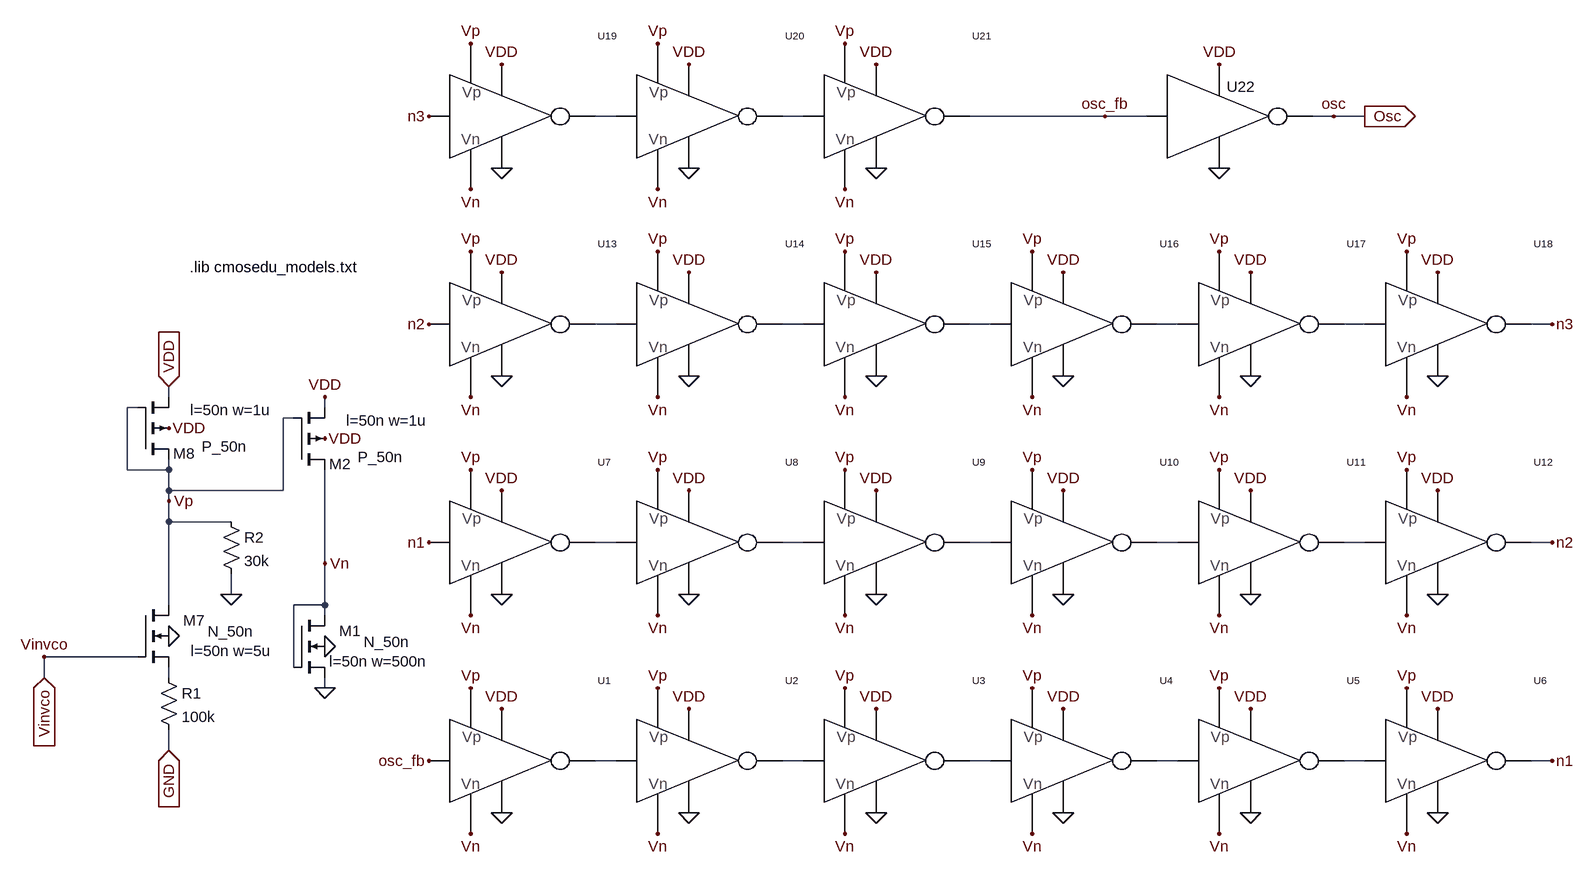
[diagram p0: schematic VCO_19_26.asc]
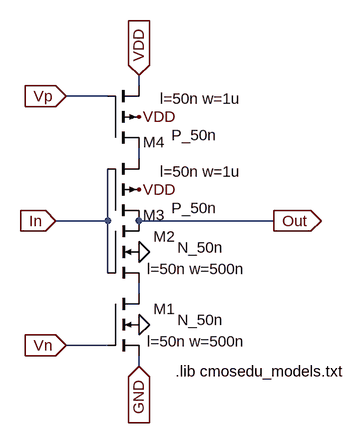
[diagram p1: sub-circuit cs_inv.asc]
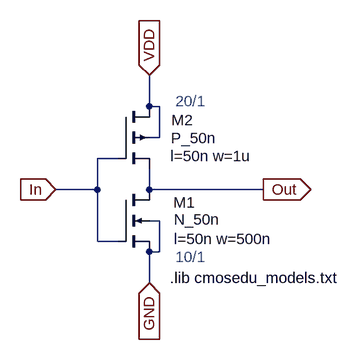
[diagram p2: sub-circuit inv_20_10.asc]
VCO_19_26.asc, the LTspice schematic file:
Version 4
SHEET 1 6288 680
WIRE 416 -528 416 -560
WIRE 544 -848 544 -944
WIRE 560 -944 544 -944
WIRE 560 -560 416 -560
WIRE 608 -960 608 -976
WIRE 608 -848 544 -848
WIRE 608 -848 608 -864
WIRE 608 -816 608 -848
WIRE 608 -800 608 -816
WIRE 608 -768 608 -800
WIRE 608 -640 608 -768
WIRE 608 -528 608 -544
WIRE 608 -416 608 -448
WIRE 704 -768 608 -768
WIRE 704 -656 704 -688
WIRE 784 -816 608 -816
WIRE 784 -816 784 -928
WIRE 800 -928 784 -928
WIRE 800 -544 800 -640
WIRE 848 -944 848 -960
WIRE 848 -704 848 -848
WIRE 848 -640 800 -640
WIRE 848 -640 848 -704
WIRE 848 -624 848 -640
WIRE 848 -512 848 -528
WIRE 1296 -1392 1264 -1392
WIRE 1296 -1072 1264 -1072
WIRE 1296 -736 1264 -736
WIRE 1296 -400 1264 -400
WIRE 1584 -1392 1552 -1392
WIRE 1584 -1072 1552 -1072
WIRE 1584 -736 1552 -736
WIRE 1584 -400 1552 -400
WIRE 1872 -1072 1840 -1072
WIRE 1872 -736 1840 -736
WIRE 1872 -400 1840 -400
WIRE 2048 -1392 1840 -1392
WIRE 2112 -1392 2048 -1392
WIRE 2160 -1072 2128 -1072
WIRE 2160 -736 2128 -736
WIRE 2160 -400 2128 -400
WIRE 2400 -1392 2368 -1392
WIRE 2448 -1392 2400 -1392
WIRE 2448 -1072 2416 -1072
WIRE 2448 -736 2416 -736
WIRE 2448 -400 2416 -400
WIRE 2736 -1072 2704 -1072
WIRE 2736 -736 2704 -736
WIRE 2736 -400 2704 -400
FLAG 416 -560 Vinvco
FLAG 608 -592 0
FLAG 608 -912 VDD
FLAG 608 -800 Vp
FLAG 1120 -480 VDD
FLAG 1120 -320 0
FLAG 1072 -512 Vp
FLAG 1072 -288 Vn
FLAG 1408 -480 VDD
FLAG 1408 -320 0
FLAG 1360 -512 Vp
FLAG 1360 -288 Vn
FLAG 1696 -480 VDD
FLAG 1696 -320 0
FLAG 1648 -512 Vp
FLAG 1648 -288 Vn
FLAG 1984 -480 VDD
FLAG 1984 -320 0
FLAG 1936 -512 Vp
FLAG 1936 -288 Vn
FLAG 2272 -480 VDD
FLAG 2272 -320 0
FLAG 2224 -512 Vp
FLAG 2224 -288 Vn
FLAG 2560 -480 VDD
FLAG 2560 -320 0
FLAG 2512 -512 Vp
FLAG 2512 -288 Vn
FLAG 1120 -816 VDD
FLAG 1120 -656 0
FLAG 1072 -848 Vp
FLAG 1072 -624 Vn
FLAG 1408 -816 VDD
FLAG 1408 -656 0
FLAG 1360 -848 Vp
FLAG 1360 -624 Vn
FLAG 1696 -816 VDD
FLAG 1696 -656 0
FLAG 1648 -848 Vp
FLAG 1648 -624 Vn
FLAG 1984 -816 VDD
FLAG 1984 -656 0
FLAG 1936 -848 Vp
FLAG 1936 -624 Vn
FLAG 2272 -816 VDD
FLAG 2272 -656 0
FLAG 2224 -848 Vp
FLAG 2224 -624 Vn
FLAG 2560 -816 VDD
FLAG 2560 -656 0
FLAG 2512 -848 Vp
FLAG 2512 -624 Vn
FLAG 1120 -1152 VDD
FLAG 1120 -992 0
FLAG 1072 -1184 Vp
FLAG 1072 -960 Vn
FLAG 1408 -1152 VDD
FLAG 1408 -992 0
FLAG 1360 -1184 Vp
FLAG 1360 -960 Vn
FLAG 1696 -1152 VDD
FLAG 1696 -992 0
FLAG 1648 -1184 Vp
FLAG 1648 -960 Vn
FLAG 1984 -1152 VDD
FLAG 1984 -992 0
FLAG 1936 -1184 Vp
FLAG 1936 -960 Vn
FLAG 2272 -1152 VDD
FLAG 2272 -992 0
FLAG 2224 -1184 Vp
FLAG 2224 -960 Vn
FLAG 2560 -1152 VDD
FLAG 2560 -992 0
FLAG 2512 -1184 Vp
FLAG 2512 -960 Vn
FLAG 1120 -1472 VDD
FLAG 1120 -1312 0
FLAG 1072 -1504 Vp
FLAG 1072 -1280 Vn
FLAG 1408 -1472 VDD
FLAG 1408 -1312 0
FLAG 1360 -1504 Vp
FLAG 1360 -1280 Vn
FLAG 1696 -1472 VDD
FLAG 1696 -1312 0
FLAG 1648 -1504 Vp
FLAG 1648 -1280 Vn
FLAG 2224 -1472 VDD
FLAG 2224 -1312 0
FLAG 2400 -1392 osc
FLAG 2048 -1392 osc_fb
FLAG 1008 -400 osc_fb
FLAG 2736 -400 n1
FLAG 1008 -736 n1
FLAG 2736 -736 n2
FLAG 1008 -1072 n2
FLAG 2736 -1072 n3
FLAG 1008 -1392 n3
FLAG 608 -976 VDD
IOPIN 608 -976 In
FLAG 608 -416 GND
IOPIN 608 -416 In
FLAG 416 -528 Vinvco
IOPIN 416 -528 In
FLAG 2448 -1392 Osc
IOPIN 2448 -1392 Out
FLAG 848 -576 0
FLAG 848 -896 VDD
FLAG 848 -960 VDD
FLAG 848 -512 0
FLAG 848 -704 Vn
FLAG 704 -656 0
SYMBOL nmos4 560 -640 R0
WINDOW 0 104 24 Right 0
WINDOW 3 179 41 Right 0
WINDOW 123 207 71 Right 0
SYMATTR InstName M7
SYMATTR Value N_50n
SYMATTR Value2 l=50n w=5u
SYMBOL pmos4 560 -864 M180
WINDOW 0 88 9 Right 0
WINDOW 3 168 20 Right 0
WINDOW 123 206 76 Right 0
SYMATTR InstName M8
SYMATTR Value P_50n
SYMATTR Value2 l=50n w=1u
SYMBOL CS_inv 1040 -464 R0
SYMATTR InstName U1
SYMBOL CS_inv 1328 -464 R0
SYMATTR InstName U2
SYMBOL CS_inv 1616 -464 R0
SYMATTR InstName U3
SYMBOL CS_inv 1904 -464 R0
SYMATTR InstName U4
SYMBOL CS_inv 2192 -464 R0
SYMATTR InstName U5
SYMBOL CS_inv 2480 -464 R0
SYMATTR InstName U6
SYMBOL CS_inv 1040 -800 R0
SYMATTR InstName U7
SYMBOL CS_inv 1328 -800 R0
SYMATTR InstName U8
SYMBOL CS_inv 1616 -800 R0
SYMATTR InstName U9
SYMBOL CS_inv 1904 -800 R0
SYMATTR InstName U10
SYMBOL CS_inv 2192 -800 R0
SYMATTR InstName U11
SYMBOL CS_inv 2480 -800 R0
SYMATTR InstName U12
SYMBOL CS_inv 1040 -1136 R0
SYMATTR InstName U13
SYMBOL CS_inv 1328 -1136 R0
SYMATTR InstName U14
SYMBOL CS_inv 1616 -1136 R0
SYMATTR InstName U15
SYMBOL CS_inv 1904 -1136 R0
SYMATTR InstName U16
SYMBOL CS_inv 2192 -1136 R0
SYMATTR InstName U17
SYMBOL CS_inv 2480 -1136 R0
SYMATTR InstName U18
SYMBOL CS_inv 1040 -1456 R0
SYMATTR InstName U19
SYMBOL CS_inv 1328 -1456 R0
SYMATTR InstName U20
SYMBOL CS_inv 1616 -1456 R0
SYMATTR InstName U21
SYMBOL INV_20_10 2144 -1456 R0
SYMATTR InstName U22
SYMBOL nmos4 800 -624 R0
WINDOW 0 104 24 Right 0
WINDOW 3 179 41 Right 0
WINDOW 123 207 71 Right 0
SYMATTR InstName M1
SYMATTR Value N_50n
SYMATTR Value2 l=50n w=500n
SYMBOL pmos4 800 -848 M180
WINDOW 0 88 9 Right 0
WINDOW 3 168 20 Right 0
WINDOW 123 206 76 Right 0
SYMATTR InstName M2
SYMATTR Value P_50n
SYMATTR Value2 l=50n w=1u
SYMBOL res 592 -544 R0
SYMATTR InstName R1
SYMATTR Value 100k
SYMBOL res 688 -784 R0
SYMATTR InstName R2
SYMATTR Value 30k
TEXT 640 -1160 Left 0 !.lib cmosedu_models.txt

cs_inv.asc, the sub-circuit schematic file:
Version 4
SHEET 1 6288 680
WIRE 608 -480 544 -480
WIRE 608 -288 528 -288
WIRE 608 -288 608 -368
WIRE 608 -208 608 -288
WIRE 608 -96 544 -96
WIRE 656 -496 656 -512
WIRE 656 -384 656 -400
WIRE 656 -176 656 -192
WIRE 656 -64 656 -80
WIRE 864 -288 656 -288
FLAG 656 -128 0
FLAG 656 -448 VDD
FLAG 656 -336 VDD
FLAG 656 -240 0
FLAG 656 -512 VDD
IOPIN 656 -512 In
FLAG 528 -288 In
IOPIN 528 -288 In
FLAG 544 -480 Vp
IOPIN 544 -480 In
FLAG 544 -96 Vn
IOPIN 544 -96 In
FLAG 864 -288 Out
IOPIN 864 -288 Out
FLAG 656 -64 GND
IOPIN 656 -64 In
SYMBOL nmos4 608 -176 R0
WINDOW 0 104 24 Right 0
WINDOW 3 179 41 Right 0
WINDOW 123 213 74 Right 0
SYMATTR InstName M1
SYMATTR Value N_50n
SYMATTR Value2 l=50n w=500n
SYMBOL pmos4 608 -400 M180
WINDOW 0 88 9 Right 0
WINDOW 3 168 20 Right 0
WINDOW 123 206 76 Right 0
SYMATTR InstName M4
SYMATTR Value P_50n
SYMATTR Value2 l=50n w=1u
SYMBOL pmos4 608 -288 M180
WINDOW 0 88 9 Right 0
WINDOW 3 168 20 Right 0
WINDOW 123 206 76 Right 0
SYMATTR InstName M3
SYMATTR Value P_50n
SYMATTR Value2 l=50n w=1u
SYMBOL nmos4 608 -288 R0
WINDOW 0 104 24 Right 0
WINDOW 3 179 41 Right 0
WINDOW 123 213 74 Right 0
SYMATTR InstName M2
SYMATTR Value N_50n
SYMATTR Value2 l=50n w=500n
TEXT 712 -56 Left 0 !.lib cmosedu_models.txt

inv_20_10.asc, the sub-circuit schematic file:
Version 4
SHEET 1 1136 680
WIRE 368 -176 304 -176
WIRE 368 -176 368 -224
WIRE 368 -96 368 -176
WIRE 400 -224 368 -224
WIRE 400 -96 368 -96
WIRE 448 -304 448 -352
WIRE 448 -176 448 -208
WIRE 448 -32 448 -80
WIRE 464 -304 448 -304
WIRE 464 -256 448 -256
WIRE 464 -256 464 -304
WIRE 464 -128 448 -128
WIRE 464 -80 448 -80
WIRE 464 -80 464 -128
WIRE 624 -176 448 -176
FLAG 304 -176 In
IOPIN 304 -176 In
FLAG 448 -352 VDD
IOPIN 448 -352 In
FLAG 448 -32 GND
IOPIN 448 -32 In
FLAG 624 -176 Out
IOPIN 624 -176 Out
SYMBOL nmos4 400 -176 R0
WINDOW 0 119 20 Right 0
WINDOW 3 157 46 Right 0
WINDOW 123 238 76 Right 0
SYMATTR InstName M1
SYMATTR Value N_50n
SYMATTR Value2 l=50n w=500n
SYMBOL pmos4 400 -304 R0
WINDOW 0 116 21 Right 0
WINDOW 3 151 49 Right 0
WINDOW 123 206 76 Right 0
SYMATTR InstName M2
SYMATTR Value P_50n
SYMATTR Value2 l=50n w=1u
TEXT 488 -312 Left 0 ;20/1
TEXT 488 -72 Left 0 ;10/1
TEXT 480 -40 Left 0 !.lib cmosedu_models.txt

The netlist it stands for:
* VCO_19_26.asc
M7 Vp Vinvco N001 0 N_50n l=50n w=5u
M8 Vp Vp VDD VDD P_50n l=50n w=1u
XU1 osc_fb N005 Vp Vn VDD 0 cs_inv
XU2 N005 N009 Vp Vn VDD 0 cs_inv
XU3 N009 N012 Vp Vn VDD 0 cs_inv
XU4 N012 N015 Vp Vn VDD 0 cs_inv
XU5 N015 N018 Vp Vn VDD 0 cs_inv
XU6 N018 n1 Vp Vn VDD 0 cs_inv
XU7 n1 N004 Vp Vn VDD 0 cs_inv
XU8 N004 N008 Vp Vn VDD 0 cs_inv
XU9 N008 N011 Vp Vn VDD 0 cs_inv
XU10 N011 N014 Vp Vn VDD 0 cs_inv
XU11 N014 N017 Vp Vn VDD 0 cs_inv
XU12 N017 n2 Vp Vn VDD 0 cs_inv
XU13 n2 N003 Vp Vn VDD 0 cs_inv
XU14 N003 N007 Vp Vn VDD 0 cs_inv
XU15 N007 N010 Vp Vn VDD 0 cs_inv
XU16 N010 N013 Vp Vn VDD 0 cs_inv
XU17 N013 N016 Vp Vn VDD 0 cs_inv
XU18 N016 n3 Vp Vn VDD 0 cs_inv
XU19 n3 N002 Vp Vn VDD 0 cs_inv
XU20 N002 N006 Vp Vn VDD 0 cs_inv
XU21 N006 osc_fb Vp Vn VDD 0 cs_inv
XU22 osc_fb osc VDD 0 inv_20_10
M1 Vn Vn 0 0 N_50n l=50n w=500n
M2 Vn Vp VDD VDD P_50n l=50n w=1u
R1 N001 GND 100k
R2 Vp 0 30k

* block symbol definitions
.subckt cs_inv In Out Vp Vn VDD GND
M1 N002 Vn GND 0 N_50n l=50n w=500n
M4 N001 Vp VDD VDD P_50n l=50n w=1u
M3 Out In N001 VDD P_50n l=50n w=1u
M2 Out In N002 0 N_50n l=50n w=500n
.lib cmosedu_models.txt
.ends cs_inv

.subckt inv_20_10 In Out VDD GND
M1 Out In GND GND N_50n l=50n w=500n
M2 VDD In Out VDD P_50n l=50n w=1u
* 20/1
* 10/1
.lib cmosedu_models.txt
.ends inv_20_10

.model NMOS NMOS
.model PMOS PMOS
.lib standard.mos
.lib cmosedu_models.txt
.backanno
.end